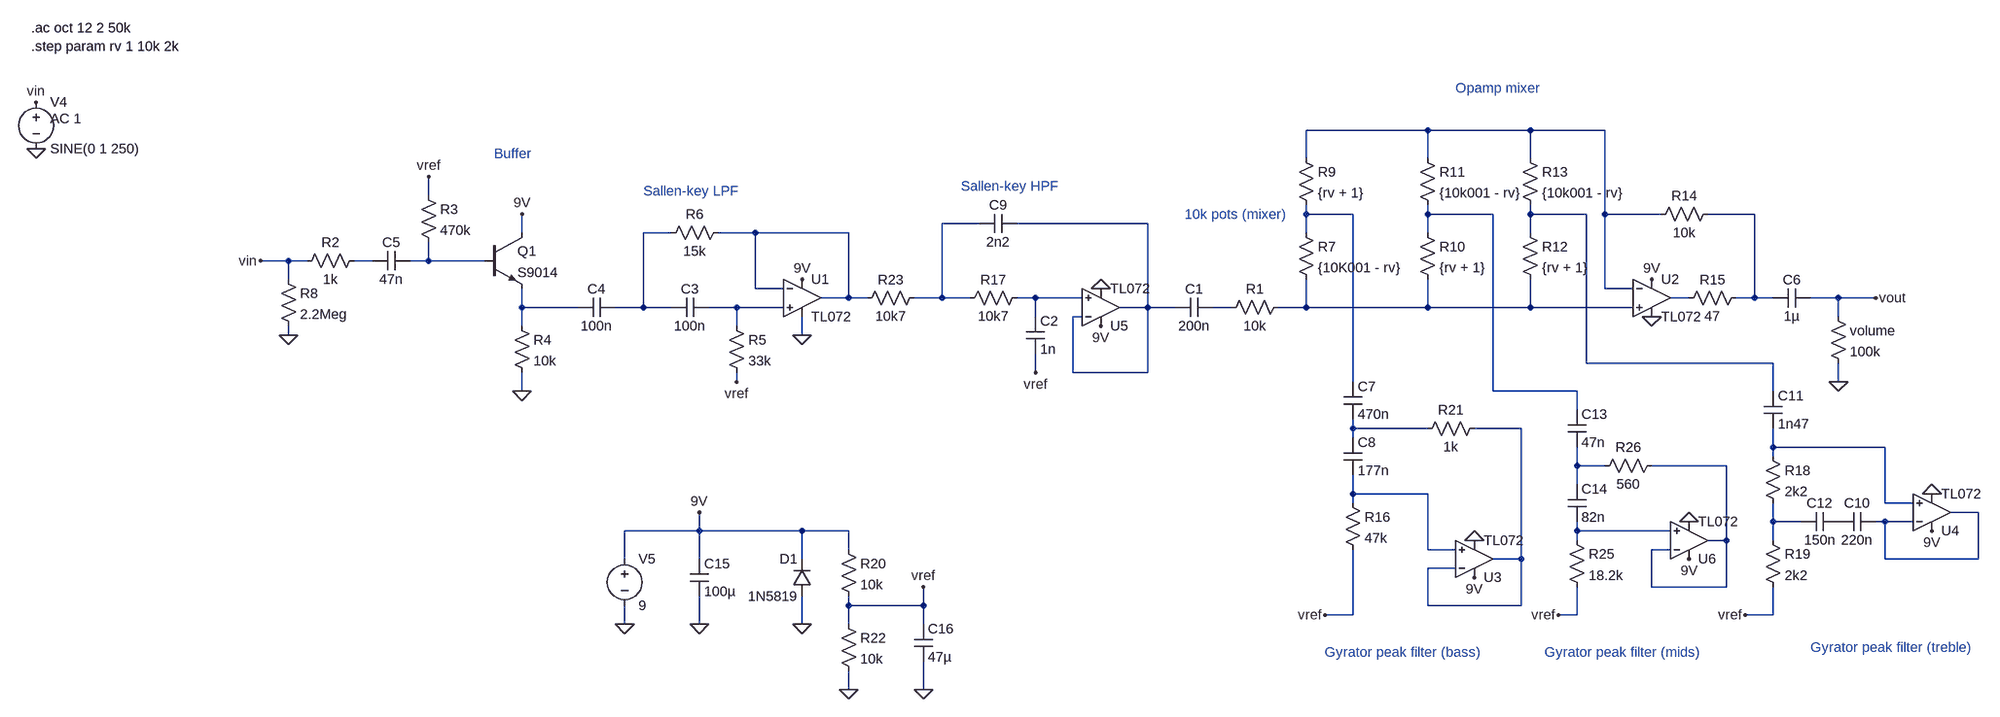
[diagram p0: schematic EQ_final.asc]
EQ_final.asc, the LTspice schematic file:
Version 4.1
SHEET 1 3092 1248
WIRE 2000 0 1792 0
WIRE 2176 0 2000 0
WIRE 2304 0 2176 0
WIRE 1792 48 1792 0
WIRE 2000 48 2000 0
WIRE 2176 48 2176 0
WIRE 288 112 288 80
WIRE 1792 144 1792 128
WIRE 1872 144 1792 144
WIRE 2000 144 2000 128
WIRE 2112 144 2000 144
WIRE 2176 144 2176 128
WIRE 2272 144 2176 144
WIRE 2304 144 2304 0
WIRE 2400 144 2304 144
WIRE 2560 144 2480 144
WIRE 1232 160 1168 160
WIRE 1520 160 1296 160
WIRE 448 176 448 144
WIRE 704 176 656 176
WIRE 848 176 784 176
WIRE 1008 176 848 176
WIRE 1792 176 1792 144
WIRE 2000 176 2000 144
WIRE 2176 176 2176 144
WIRE 48 224 0 224
WIRE 80 224 48 224
WIRE 192 224 160 224
WIRE 288 224 288 192
WIRE 288 224 256 224
WIRE 384 224 288 224
WIRE 48 256 48 224
WIRE 848 272 848 176
WIRE 896 272 848 272
WIRE 2304 272 2304 144
WIRE 2352 272 2304 272
WIRE 1008 288 1008 176
WIRE 1008 288 960 288
WIRE 1040 288 1008 288
WIRE 1168 288 1168 160
WIRE 1168 288 1120 288
WIRE 1216 288 1168 288
WIRE 1328 288 1296 288
WIRE 1408 288 1328 288
WIRE 2448 288 2416 288
WIRE 2560 288 2560 144
WIRE 2560 288 2528 288
WIRE 2592 288 2560 288
WIRE 2704 288 2656 288
WIRE 2768 288 2704 288
WIRE 448 304 448 272
WIRE 544 304 448 304
WIRE 656 304 656 176
WIRE 656 304 608 304
WIRE 704 304 656 304
WIRE 816 304 768 304
WIRE 896 304 816 304
WIRE 1520 304 1520 160
WIRE 1520 304 1472 304
WIRE 1568 304 1520 304
WIRE 1664 304 1632 304
WIRE 1792 304 1792 256
WIRE 1792 304 1744 304
WIRE 2000 304 2000 256
WIRE 2000 304 1792 304
WIRE 2176 304 2176 256
WIRE 2176 304 2000 304
WIRE 2352 304 2176 304
WIRE 1328 320 1328 288
WIRE 1408 320 1392 320
WIRE 2704 320 2704 288
WIRE 448 336 448 304
WIRE 816 336 816 304
WIRE 48 352 48 336
WIRE 928 352 928 320
WIRE 2272 400 2272 144
WIRE 2592 400 2272 400
WIRE 1328 416 1328 384
WIRE 1392 416 1392 320
WIRE 1520 416 1520 304
WIRE 1520 416 1392 416
WIRE 816 432 816 416
WIRE 1872 432 1872 144
WIRE 2704 432 2704 400
WIRE 448 448 448 416
WIRE 2112 448 2112 144
WIRE 2256 448 2112 448
WIRE 2592 448 2592 400
WIRE 2256 480 2256 448
WIRE 1872 512 1872 496
WIRE 2000 512 1872 512
WIRE 2160 512 2080 512
WIRE 1872 528 1872 512
WIRE 2592 544 2592 512
WIRE 2784 544 2592 544
WIRE 2592 560 2592 544
WIRE 2256 576 2256 544
WIRE 2304 576 2256 576
WIRE 2512 576 2384 576
WIRE 2256 608 2256 576
WIRE 1872 624 1872 592
WIRE 2000 624 1872 624
WIRE 1872 640 1872 624
WIRE 2784 640 2784 544
WIRE 2832 640 2784 640
WIRE 2944 656 2896 656
WIRE 2592 672 2592 640
WIRE 2640 672 2592 672
WIRE 2784 672 2768 672
WIRE 2832 672 2784 672
WIRE 752 688 752 656
WIRE 752 688 624 688
WIRE 928 688 752 688
WIRE 1008 688 928 688
WIRE 2256 688 2256 672
WIRE 2416 688 2256 688
WIRE 2256 704 2256 688
WIRE 2512 704 2512 576
WIRE 2512 704 2480 704
WIRE 2592 704 2592 672
WIRE 1008 720 1008 688
WIRE 2000 720 2000 624
WIRE 2048 720 2000 720
WIRE 2416 720 2384 720
WIRE 624 736 624 688
WIRE 752 736 752 688
WIRE 928 736 928 688
WIRE 2160 736 2160 512
WIRE 2160 736 2112 736
WIRE 2784 736 2784 672
WIRE 2944 736 2944 656
WIRE 2944 736 2784 736
WIRE 2048 752 2000 752
WIRE 2384 784 2384 720
WIRE 2512 784 2512 704
WIRE 2512 784 2384 784
WIRE 1008 816 1008 800
WIRE 1136 816 1136 784
WIRE 1136 816 1008 816
WIRE 2000 816 2000 752
WIRE 2160 816 2160 736
WIRE 2160 816 2000 816
WIRE 1872 832 1872 720
WIRE 1872 832 1824 832
WIRE 2256 832 2256 784
WIRE 2256 832 2224 832
WIRE 2592 832 2592 784
WIRE 2592 832 2544 832
WIRE 624 848 624 816
WIRE 752 848 752 800
WIRE 928 848 928 800
WIRE 1008 848 1008 816
WIRE 1136 848 1136 816
WIRE 1008 960 1008 928
WIRE 1136 960 1136 912
FLAG 0 224 vin
FLAG 48 352 0
FLAG 288 80 vref
FLAG 448 144 9V
FLAG 448 448 0
FLAG -1408 32 0
FLAG -1408 -48 vin
FLAG 928 352 0
FLAG 928 256 9V
FLAG 816 432 vref
FLAG 2384 320 0
FLAG 2384 256 9V
FLAG 1824 832 vref
FLAG 2080 704 0
FLAG 2080 768 9V
FLAG 2544 832 vref
FLAG 2864 624 0
FLAG 2864 688 9V
FLAG 2704 432 0
FLAG 2768 288 vout
FLAG 1440 336 9V
FLAG 1328 416 vref
FLAG 2224 832 vref
FLAG 2448 672 0
FLAG 2448 736 9V
FLAG 1440 272 0
FLAG 624 848 0
FLAG 752 656 9V
FLAG 752 848 0
FLAG 928 848 0
FLAG 1008 960 0
FLAG 1136 960 0
FLAG 1136 784 vref
SYMBOL cap 256 208 R90
WINDOW 0 0 32 VBottom 2
WINDOW 3 32 32 VTop 2
SYMATTR InstName C5
SYMATTR Value 47n
SYMBOL res 32 240 R0
SYMATTR InstName R8
SYMATTR Value 2.2Meg
SYMBOL res 176 208 R90
WINDOW 0 0 56 VBottom 2
WINDOW 3 32 56 VTop 2
SYMATTR InstName R2
SYMATTR Value 1k
SYMBOL res 272 96 R0
SYMATTR InstName R3
SYMATTR Value 470k
SYMBOL npn 384 176 R0
SYMATTR InstName Q1
SYMATTR Value S9014
SYMBOL res 432 320 R0
SYMATTR InstName R4
SYMATTR Value 10k
SYMBOL voltage -1408 -64 R0
WINDOW 123 24 44 Left 2
WINDOW 39 0 0 Left 0
SYMATTR Value2 AC 1
SYMATTR InstName V4
SYMATTR Value SINE(0 1 250)
SYMBOL cap 608 288 R90
WINDOW 0 0 32 VBottom 2
WINDOW 3 32 32 VTop 2
SYMATTR InstName C4
SYMATTR Value 100n
SYMBOL cap 768 288 R90
WINDOW 0 0 32 VBottom 2
WINDOW 3 32 32 VTop 2
SYMATTR InstName C3
SYMATTR Value 100n
SYMBOL res 800 320 R0
SYMATTR InstName R5
SYMATTR Value 33k
SYMBOL OpAmps\\TL072 928 224 R0
SYMATTR InstName U1
SYMBOL res 800 160 R90
WINDOW 0 0 56 VBottom 2
WINDOW 3 32 56 VTop 2
SYMATTR InstName R6
SYMATTR Value 15k
SYMBOL cap 1632 288 R90
WINDOW 0 0 32 VBottom 2
WINDOW 3 32 32 VTop 2
SYMATTR InstName C1
SYMATTR Value 200n
SYMBOL res 1760 288 R90
WINDOW 0 0 56 VBottom 2
WINDOW 3 32 56 VTop 2
SYMATTR InstName R1
SYMATTR Value 10k
SYMBOL res 1776 160 R0
SYMATTR InstName R7
SYMATTR Value {10K001 - rv}
SYMBOL res 1776 32 R0
SYMATTR InstName R9
SYMATTR Value {rv + 1}
SYMBOL res 1984 160 R0
SYMATTR InstName R10
SYMATTR Value {rv + 1}
SYMBOL res 1984 32 R0
SYMATTR InstName R11
SYMATTR Value {10k001 - rv}
SYMBOL res 2160 160 R0
SYMATTR InstName R12
SYMATTR Value {rv + 1}
SYMBOL res 2160 32 R0
SYMATTR InstName R13
SYMATTR Value {10k001 - rv}
SYMBOL OpAmps\\TL072 2384 224 R0
SYMATTR InstName U2
SYMBOL res 2544 272 R90
WINDOW 0 0 56 VBottom 2
WINDOW 3 32 56 VTop 2
SYMATTR InstName R15
SYMATTR Value 47
SYMBOL res 2496 128 R90
WINDOW 0 0 56 VBottom 2
WINDOW 3 32 56 VTop 2
SYMATTR InstName R14
SYMATTR Value 10k
SYMBOL cap 2656 272 R90
WINDOW 0 0 32 VBottom 2
WINDOW 3 32 32 VTop 2
SYMATTR InstName C6
SYMATTR Value 1µ
SYMBOL cap 1856 432 R0
SYMATTR InstName C7
SYMATTR Value 470n
SYMBOL cap 1856 528 R0
SYMATTR InstName C8
SYMATTR Value 177n
SYMBOL res 1856 624 R0
SYMATTR InstName R16
SYMATTR Value 47k
SYMBOL OpAmps\\TL072 2080 800 M180
SYMATTR InstName U3
SYMBOL cap 2576 448 R0
SYMATTR InstName C11
SYMATTR Value 1n47
SYMBOL res 2576 544 R0
SYMATTR InstName R18
SYMATTR Value 2k2
SYMBOL res 2576 688 R0
SYMATTR InstName R19
SYMATTR Value 2k2
SYMBOL OpAmps\\TL072 2864 720 M180
SYMATTR InstName U4
SYMBOL cap 2704 656 R90
WINDOW 0 0 32 VBottom 2
WINDOW 3 32 32 VTop 2
SYMATTR InstName C12
SYMATTR Value 150n
SYMBOL cap 2768 656 R90
WINDOW 0 0 32 VBottom 2
WINDOW 3 32 32 VTop 2
SYMATTR InstName C10
SYMATTR Value 220n
SYMBOL res 2688 304 R0
SYMATTR InstName volume
SYMATTR Value 100k
SYMBOL res 2096 496 R90
WINDOW 0 0 56 VBottom 2
WINDOW 3 32 56 VTop 2
SYMATTR InstName R21
SYMATTR Value 1k
SYMBOL OpAmps\\TL072 1440 368 M180
SYMATTR InstName U5
SYMBOL res 1136 272 R90
WINDOW 0 0 56 VBottom 2
WINDOW 3 32 56 VTop 2
SYMATTR InstName R23
SYMATTR Value 10k7
SYMBOL cap 1312 320 R0
SYMATTR InstName C2
SYMATTR Value 1n
SYMBOL res 1312 272 R90
WINDOW 0 0 56 VBottom 2
WINDOW 3 32 56 VTop 2
SYMATTR InstName R17
SYMATTR Value 10k7
SYMBOL cap 1296 144 R90
WINDOW 0 0 32 VBottom 2
WINDOW 3 32 32 VTop 2
SYMATTR InstName C9
SYMATTR Value 2n2
SYMBOL cap 2240 480 R0
SYMATTR InstName C13
SYMATTR Value 47n
SYMBOL cap 2240 608 R0
SYMATTR InstName C14
SYMATTR Value 82n
SYMBOL res 2240 688 R0
SYMATTR InstName R25
SYMATTR Value 18.2k
SYMBOL OpAmps\\TL072 2448 768 M180
SYMATTR InstName U6
SYMBOL res 2400 560 R90
WINDOW 0 0 56 VBottom 2
WINDOW 3 32 56 VTop 2
SYMATTR InstName R26
SYMATTR Value 560
SYMBOL voltage 624 720 R0
WINDOW 123 0 0 Left 0
WINDOW 39 0 0 Left 0
SYMATTR InstName V5
SYMATTR Value 9
SYMBOL cap 736 736 R0
SYMATTR InstName C15
SYMATTR Value 100µ
SYMBOL diode 944 800 R180
WINDOW 0 24 64 Left 2
WINDOW 3 24 0 Left 2
SYMATTR InstName D1
SYMATTR Value 1N5819
SYMATTR Description Diode
SYMATTR Type diode
SYMBOL res 992 704 R0
SYMATTR InstName R20
SYMATTR Value 10k
SYMBOL res 992 832 R0
SYMATTR InstName R22
SYMATTR Value 10k
SYMBOL cap 1120 848 R0
SYMATTR InstName C16
SYMATTR Value 47µ
TEXT -1416 -176 Left 2 !.ac oct 12 2 50k
TEXT -1416 -144 Left 2 !.step param rv 1 10k 2k
TEXT 400 40 Left 2 ;Buffer
TEXT 656 104 Left 2 ;Sallen-key LPF
TEXT 1200 96 Left 2 ;Sallen-key HPF
TEXT 2048 -72 Left 2 ;Opamp mixer
TEXT 1824 896 Left 2 ;Gyrator peak filter (bass)
TEXT 2200 896 Left 2 ;Gyrator peak filter (mids)
TEXT 2656 888 Left 2 ;Gyrator peak filter (treble)
TEXT 1584 144 Left 2 ;10k pots (mixer)

The netlist it stands for:
* EQ_final.asc
C5 N011 N010 47n
R8 vin 0 2.2Meg
R2 N010 vin 1k
R3 vref N011 470k
Q1 9V N011 N014 0 S9014
R4 N014 0 10k
V4 vin 0 SINE(0 1 250) AC 1
C4 N008 N014 100n
C3 N015 N008 100n
R5 N015 vref 33k
X§U1 N015 N009 9V 0 N009 TL072  ; pins In+ In- V+ V- OUT
R6 N009 N008 15k
C1 N016 N007 200n
R1 N017 N016 10k
R7 N002 N017 {10K001 - rv}
R9 N001 N002 {rv + 1}
R10 N003 N017 {rv + 1}
R11 N001 N003 {10k001 - rv}
R12 N004 N017 {rv + 1}
R13 N001 N004 {10k001 - rv}
X§U2 N017 N001 9V 0 N013 TL072  ; pins In+ In- V+ V- OUT
R15 N005 N013 47
R14 N005 N001 10k
C6 vout N005 1µ
C7 N002 N018 470n
C8 N018 N023 177n
R16 N023 vref 47k
X§U3 N023 N019 9V 0 N019 TL072  ; pins In+ In- V+ V- OUT
C11 N004 N020 1n47
R18 N020 N025 2k2
R19 N025 vref 2k2
X§U4 N020 N024 9V 0 N024 TL072  ; pins In+ In- V+ V- OUT
C12 P001 N025 150n
C10 N024 P001 220n
R§volume vout 0 100k
R21 N019 N018 1k
X§U5 N012 N007 9V 0 N007 TL072  ; pins In+ In- V+ V- OUT
R23 N006 N009 10k7
C2 N012 vref 1n
R17 N012 N006 10k7
C9 N007 N006 2n2
C13 N003 N021 47n
C14 N021 N026 82n
R25 N026 vref 18.2k
X§U6 N026 N022 9V 0 N022 TL072  ; pins In+ In- V+ V- OUT
R26 N022 N021 560
V5 9V 0 9
C15 9V 0 100µ
D1 0 9V 1N5819
R20 9V vref 10k
R22 vref 0 10k
C16 vref 0 47µ
.model D D
.lib standard.dio
.model NPN NPN
.model PNP PNP
.lib standard.bjt
.ac oct 12 2 50k
.step param rv 1 10k 2k
* Buffer
* Sallen-key LPF
* Sallen-key HPF
* Opamp mixer
* Gyrator peak filter (bass)
* Gyrator peak filter (mids)
* Gyrator peak filter (treble)
* 10k pots (mixer)
.backanno
.end